# Altium schematic sheet Digital-input.SchDoc
size A3
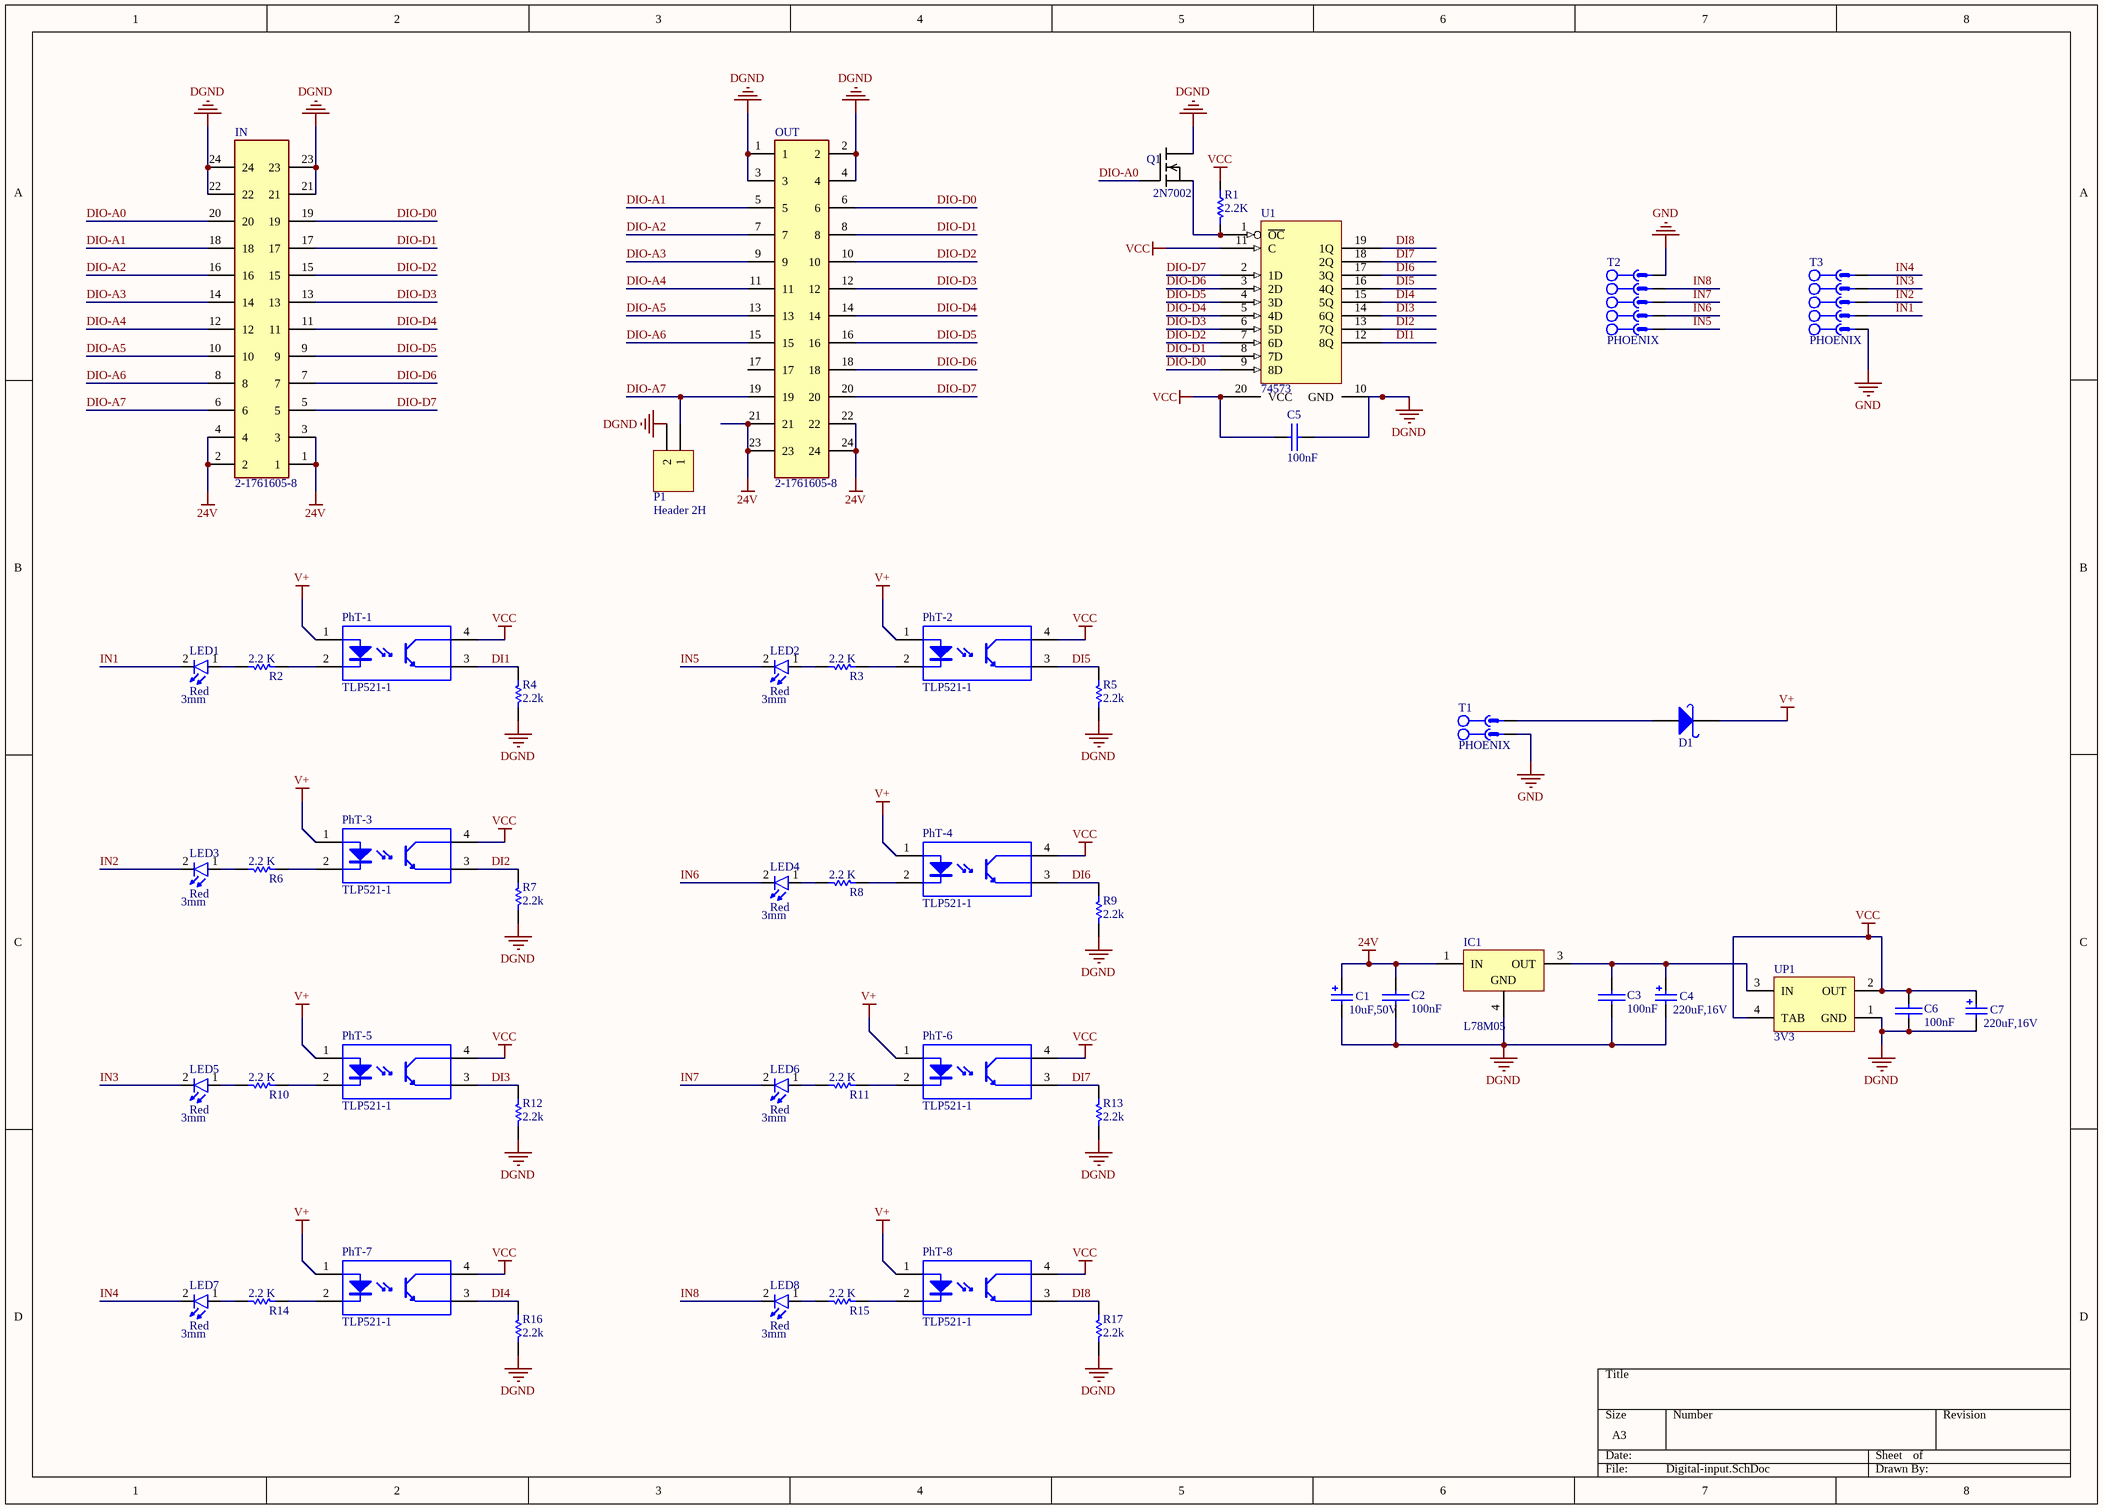
[diagram p0: Digital-input.SchDoc]

## Parts
C1  10uF,50V  [WCAP-AS5H_6.3x7.7]
C2  100nF  [SMD_CAP_0805]
C3  100nF  [SMD_CAP_0805]
C4  220uF,16V  [WCAP-AS5H_6.3x7.7]
C5  100nF  [SMD_CAP_0805]
C6  100nF  [SMD_CAP_0805]
C7  220uF,16V  [WCAP-AS5H_6.3x7.7]
D1  1n5822  [Diode 1N4007 SMD]  (value not drawn)
IC1  L78M05  [TO-252]
IN  2-1761605-8  [TE_2-1761605-8]
LED1  Size: 3mm  [LED-3mm]  (hidden comment: Red)
LED2  Size: 3mm  [LED-3mm]  (hidden comment: Red)
LED3  Size: 3mm  [LED-3mm]  (hidden comment: Red)
LED4  Size: 3mm  [LED-3mm]  (hidden comment: Red)
LED5  Size: 3mm  [LED-3mm]  (hidden comment: Red)
LED6  Size: 3mm  [LED-3mm]  (hidden comment: Red)
LED7  Size: 3mm  [LED-3mm]  (hidden comment: Red)
LED8  Size: 3mm  [LED-3mm]  (hidden comment: Red)
OUT  2-1761605-8  [TE_2-1761605-8]
P1  Header 2H  [HDR1X2H]
PhT-1  TLP521-1  [PCBComponent_1]
PhT-2  TLP521-1  [PCBComponent_1]
PhT-3  TLP521-1  [PCBComponent_1]
PhT-4  TLP521-1  [PCBComponent_1]
PhT-5  TLP521-1  [PCBComponent_1]
PhT-6  TLP521-1  [PCBComponent_1]
PhT-7  TLP521-1  [PCBComponent_1]
PhT-8  TLP521-1  [PCBComponent_1]
Q1  2N7002  [*SOT23]
R1  2.2K  [RES 0805 (2012X06L)]
R2  2.2 K  [RES 1206 (3216X08L)]
R3  2.2 K  [RES 1206 (3216X08L)]
R4  2.2k  [RES 1206 (3216X08L)]
R5  2.2k  [RES 1206 (3216X08L)]
R6  2.2 K  [RES 1206 (3216X08L)]
R7  2.2k  [RES 1206 (3216X08L)]
R8  2.2 K  [RES 1206 (3216X08L)]
R9  2.2k  [RES 1206 (3216X08L)]
R10  2.2 K  [RES 1206 (3216X08L)]
R11  2.2 K  [RES 1206 (3216X08L)]
R12  2.2k  [RES 1206 (3216X08L)]
R13  2.2k  [RES 1206 (3216X08L)]
R14  2.2 K  [RES 1206 (3216X08L)]
R15  2.2 K  [RES 1206 (3216X08L)]
R16  2.2k  [RES 1206 (3216X08L)]
R17  2.2k  [RES 1206 (3216X08L)]
T1  PHOENIX  [MSTB 2,5/2-G-5,08]
T2  PHOENIX  [MSTB 2,5/5-G-5,08]
T3  PHOENIX  [MSTB 2,5/5-G-5,08]
U1  74573  [SO20_M]
UP1  3V3  [SOT223]

## Nets
24V: C1.2(P) C2.2(-) IC1.1(IN) IN.1 IN.2 IN.3 IN.4 OUT.21 OUT.22 OUT.23 OUT.24
DGND: C1.1(N) C2.1(+) C3.1(+) C4.1(N) C5.1(+) C6.1(+) C7.1(N) IC1.4(GND) IN.21 IN.22 IN.23 IN.24 OUT.1 OUT.2 OUT.3 OUT.4 P1.2 Q1.3(D) R4.2 R5.2 R7.2 R9.2 R12.2 R13.2 R16.2 R17.2 T1.1 T2.5 T3.1 U1.10(GND) UP1.1(GND)  [also labelled GND]
V+: D1.2(K) PhT-1.1(A) PhT-2.1(A) PhT-3.1(A) PhT-4.1(A) PhT-5.1(A) PhT-6.1(A) PhT-7.1(A) PhT-8.1(A)
VCC: C5.2(-) C6.2(-) C7.2(P) PhT-1.4(C) PhT-2.4(C) PhT-3.4(C) PhT-4.4(C) PhT-5.4(C) PhT-6.4(C) PhT-7.4(C) PhT-8.4(C) R1.1 U1.11(C) U1.20(VCC) UP1.2(OUT) UP1.4(TAB)
DI1: PhT-1.3(E) R4.1 U1.12(8Q)
DI2: PhT-3.3(E) R7.1 U1.13(7Q)
DI3: PhT-5.3(E) R12.1 U1.14(6Q)
DI4: PhT-7.3(E) R16.1 U1.15(5Q)
DI5: PhT-2.3(E) R5.1 U1.16(4Q)
DI6: PhT-4.3(E) R9.1 U1.17(3Q)
DI7: PhT-6.3(E) R13.1 U1.18(2Q)
DI8: PhT-8.3(E) R17.1 U1.19(1Q)
DIO-A0: IN.20 Q1.1(G)
DIO-A1: IN.18 OUT.5
DIO-A2: IN.16 OUT.7
DIO-A3: IN.14 OUT.9
DIO-A4: IN.12 OUT.11
DIO-A5: IN.10 OUT.13
DIO-A6: IN.8 OUT.15
DIO-A7: IN.6 OUT.19 P1.1
DIO-D0: IN.19 OUT.6 U1.9(8D)
DIO-D1: IN.17 OUT.8 U1.8(7D)
DIO-D2: IN.15 OUT.10 U1.7(6D)
DIO-D3: IN.13 OUT.12 U1.6(5D)
DIO-D4: IN.11 OUT.14 U1.5(4D)
DIO-D5: IN.9 OUT.16 U1.4(3D)
DIO-D6: IN.7 OUT.18 U1.3(2D)
DIO-D7: IN.5 OUT.20 U1.2(1D)
IN1: LED1.2(K) T3.2
IN2: LED3.2(K) T3.3
IN3: LED5.2(K) T3.4
IN4: LED7.2(K) T3.5
IN5: LED2.2(K) T2.1
IN6: LED4.2(K) T2.2
IN7: LED6.2(K) T2.3
IN8: LED8.2(K) T2.4
NetC3_2: C3.2(-) C4.2(P) IC1.3(OUT) UP1.3(IN)
NetD1_1: D1.1(A) T1.2
NetLED1_1: LED1.1(A) R2.2
NetLED2_1: LED2.1(A) R3.2
NetLED3_1: LED3.1(A) R6.2
NetLED4_1: LED4.1(A) R8.2
NetLED5_1: LED5.1(A) R10.2
NetLED6_1: LED6.1(A) R11.2
NetLED7_1: LED7.1(A) R14.2
NetLED8_1: LED8.1(A) R15.2
NetPhT-1_2: PhT-1.2(K) R2.1
NetPhT-2_2: PhT-2.2(K) R3.1
NetPhT-3_2: PhT-3.2(K) R6.1
NetPhT-4_2: PhT-4.2(K) R8.1
NetPhT-5_2: PhT-5.2(K) R10.1
NetPhT-6_2: PhT-6.2(K) R11.1
NetPhT-7_2: PhT-7.2(K) R14.1
NetPhT-8_2: PhT-8.2(K) R15.1
NetQ1_2: Q1.2(S) R1.2 U1.1(~{OC})

Not connected (* = marked no-connect by the designer): OUT 17

## Library data of the parts
C1 = 865230653012: WCAP-AS5H SMT Aluminum Electrolytic Capacitors, D8mm x L10.5mm, 47uF, +/-20%, 50VDC; Dissipation Factor: 12%; Endurance: 5000h; Leakage Current: 23.5uA; Ripple Current max.: 95mA; Technical Reference: ASDE105470M050DVCTEE000; ComponentLink1Description: Manufacturer; ComponentLink1URL: http://www.we-online.de; ComponentLink2Description: Datasheet; ComponentLink2URL: https://katalog.we-online.com/pbs/datasheet/865230653012.pdf; Length: 10.5mm; Mounting Technology: SMT; Operating Temperature: -40 to +105degC; Packaging: Tape and Reel; Published Date: August 2019; Capacitance: 47uF; Diameter: 8mm; Part Number: 865230653012; Publisher: Wurth Elektronik; Capacitance Tolerance: +/-20%; Rated Voltage: 50VDC
C2 C3 C5 C6 = Cap-Bipolar: Bipolar Capacitor; Voltage: 100V; Designer: Saeid Jorablo; Organazation: ControTec; Adding Date: 1387/12/20; Value: 100nF
C4 C7 = 865230345005: WCAP-AS5H SMT Aluminum Electrolytic Capacitors, D6.3mm x L7.7mm, 100uF, +/-20%, 16VDC; Dissipation Factor: 22%; Endurance: 5000h; Leakage Current: 16uA; Ripple Current max.: 81mA; Technical Reference: ASDD077101M016DVCTCE000; ComponentLink1Description: Manufacturer; ComponentLink1URL: http://www.we-online.de; ComponentLink2Description: Datasheet; ComponentLink2URL: https://katalog.we-online.com/pbs/datasheet/865230345005.pdf; Length: 7.7mm; Mounting Technology: SMT; Operating Temperature: -40 to +105degC; Packaging: Tape and Reel; Published Date: August 2019; Capacitance: 100uF; Diameter: 6.3mm; Part Number: 865230345005; Publisher: Wurth Elektronik; Capacitance Tolerance: +/-20%; Rated Voltage: 16VDC
D1 = 1N5822 SMD: Schottky Rectifiers; Part. No: SS34; Manufacturer: ON Semiconductor/Fairchild; Designer: Abbas Basereh; Link: https://www.aliexpress.com/item/Free-shipping-100pcs-1n5822-sma-smd-do-214ac-Schottky-diode-ss34/32337482329.html?spm=2114.01010208.3.1.zLZDsP&ws_ab_test=searchweb0_0,searchweb201602_4_10065_10068_10084_10083_10080_10082_10081_10060_10061_10062_10056_10055_10054_10059_10099_10078_10079_427_10073_10103_10102_10096_10052_10050_10051,searchweb201603_4&btsid=6e50dc92-ac69-45bc-a19e-209af19ce602; Link: http://www.tme.eu/en/details/ss34/smd-schottky-diodes/vishay/ss34-e357t/; Link: http://www.digikey.com/product-detail/en/on-semiconductor-fairchild/SS34/SS34FSCT-ND/2094459; Data: 16-12-2016
IC1 = L78M05: Precision 500mA Regulator
IN OUT = 2-1761605-8: IDC LOW PRO HDR 64P RA BLUE; Package: None; Price: None; Value: *; MP: 2-1761605-8; Availability: Unavailable
LED1-LED8 = LED: Designer: Saeid Jorablo; Organazation: ControTec; Adding Date: 1387/12/22; Color: Red
P1 = Header 2H: Header, 2-Pin, Right Angle; LatestRevisionDate: 17-Jul-2002; LatestRevisionNote: Re-released for DXP Platform.; Publisher: Altium Limited
Q1 = 2N7002: Transistor NPN Mos 2N7002 SILICONIX miliampere=100 V=60 SOt23; MF: STMicroelectronics; Availability: Unavailable; SnapEDA_Link: https://www.snapeda.com/parts/2N7002/STMicroelectronics/view-part/?ref=snap; Price: None; Package: SOT-23-3 Vishay; MP: 2N7002; Value: *
R1 = Resistor: Tolerance: 5%; Power: 1/8 W; Value: 2.2K
R2-R17 = RESISTOR: Semiconductor Resistor; Value: 1K; Published: 8-Jun-2000; LatestRevisionDate: 17-Jul-2002; LatestRevisionNote: Re-released for DXP Platform.; PackageReference: AXIAL-0.5; Publisher: Altium Limited
T1 = CON_Phoenix_MSTB_02: 2 Pitch: 5.08 mm Color: green Contact surface: Tin Assembly; Manufacturer: PHOENIX CONTACT; Connector type: PCB Terminal Block; designer: ABBAS BASEREH; Max Current: 12 A; Positions: 2; Voltage: 320 V; Category: Connector; ComponentLink1Description: Header, Nominal current: 12 A Rated voltage (III/2): 320 V Number of positions: 2 Pitch: 5.08 mm Color: green Contact surface: Tin Assembly: Soldering  DESIGNER:ABBAS BASEREH; ComponentLink2Description: Reference; Mounting Technology: Through-Hole; Pin Count: 2; Revision 1: 2017-3-1; Status: Unreleased; PART.NO: PHOENIX
T2 T3 = CON_Phoenix_MSTB_05: 5 Pitch: 5.08 mm Color: green Contact surface: Tin Assembly; Manufacturer: PHOENIX CONTACT; Connector type: PCB Terminal Block; designer: ABBAS BASEREH; Max Current: 12 A; Positions: 5; Voltage: 320 V; Category: Connector; ComponentLink1Description: Header, Nominal current: 12 A Rated voltage (III/2): 320 V Number of positions: 5 Pitch: 5.08 mm Color: green Contact surface: Tin Assembly: Soldering  DESIGNER:ABBAS BASEREH; ComponentLink2Description: Reference; Mounting Technology: Through-Hole; Pin Count: 5; Revision 1: 2017-3-1; Status: Unreleased; PART.NO: PHOENIX
U1 = 74573: OCTAL D-TYPE TRANSPARENT LCH
UP1 = AMS1117-x.x: x.x Volt, 800mA Low-Dropout Linear Regulator, 4-pin SOT-223; Designer: Ali Hafizi; Data: 16-12-2016